# EAGLE design isibtvschema (EAGLE 9.5.1)
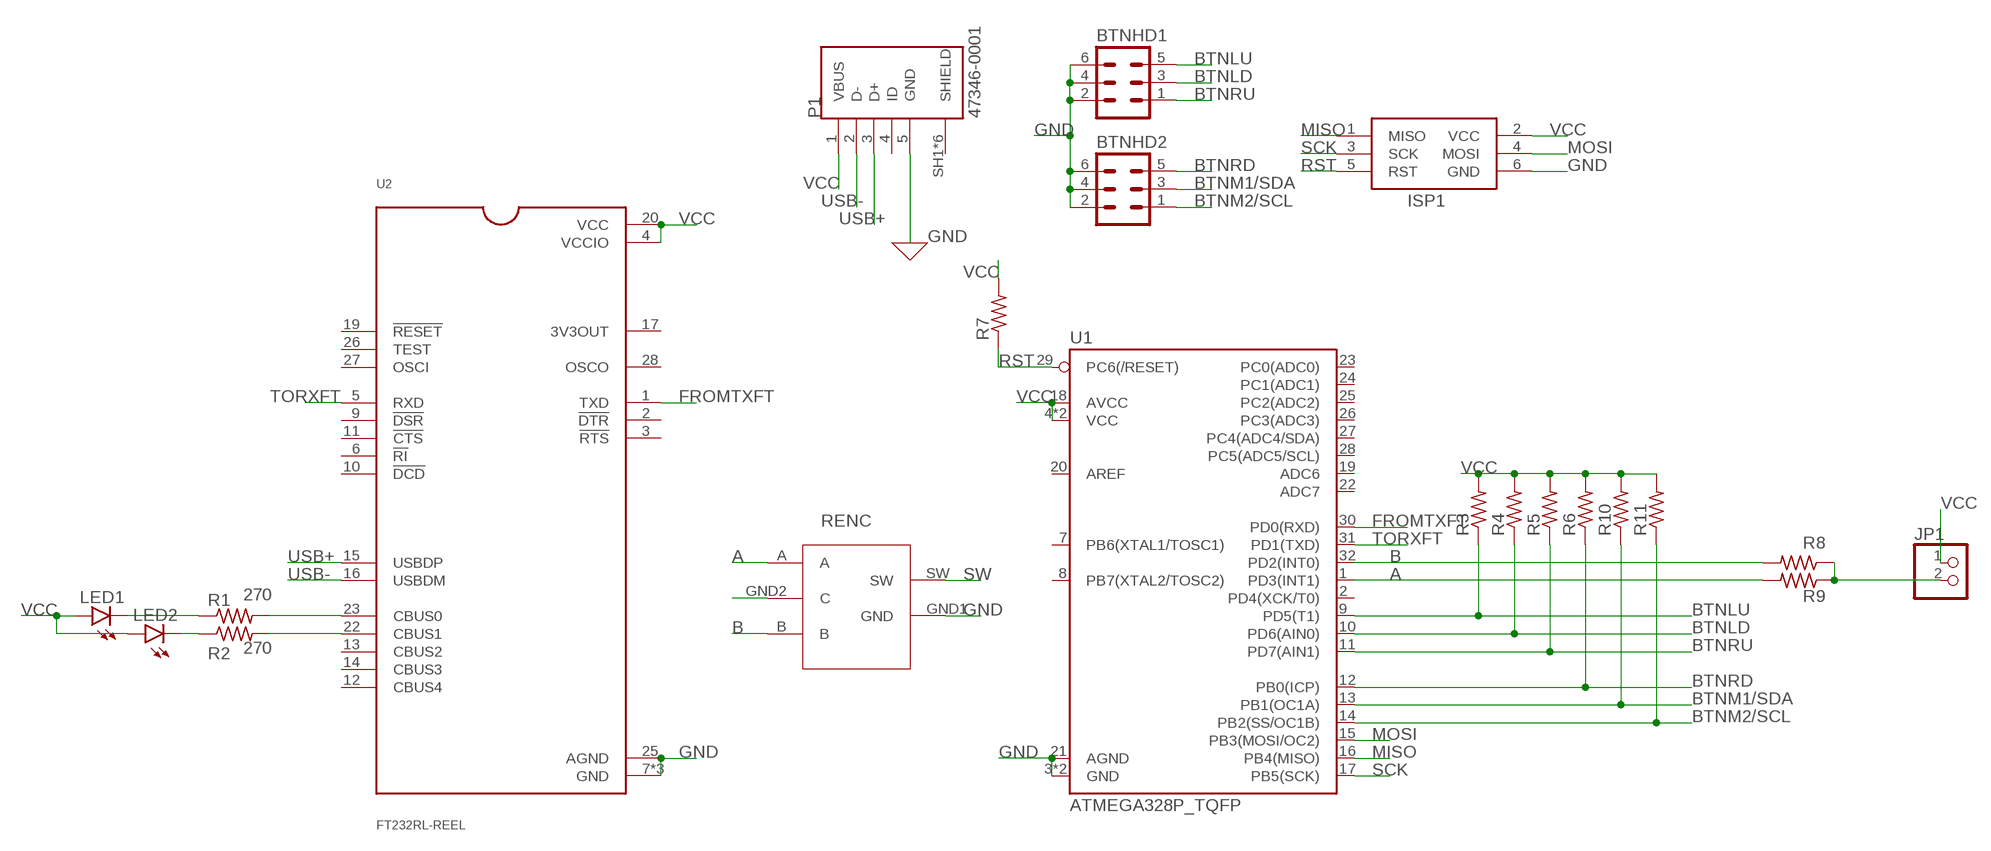
[diagram p0: schematic, sheet 1]

## Parts
BTNHD1  MA03-2  [MA03-2]
BTNHD2  MA03-2  [MA03-2]
ISP1  AVRISP-6  [AVRISP]
JP1  PINHD-1X2  [1X02]
LED1  LED5MM  [LED5MM]
LED2  LED5MM  [LED5MM]
P1  47346-0001  [MOLEX_47346-0001]
R1  270  R-US_0207/10  [0207/10]
R2  270  R-US_0207/10  [0207/10]
R3  R-US_0207/10  [0207/10]
R4  R-US_0207/10  [0207/10]
R5  R-US_0207/10  [0207/10]
R6  R-US_0207/10  [0207/10]
R7  R-US_0207/10  [0207/10]
R8  R-US_0207/10  [0207/10]
R9  R-US_0207/10  [0207/10]
R10  R-US_0207/10  [0207/10]
R11  R-US_0207/10  [0207/10]
RENC  RE11  [RE11]
U1  ATMEGA328P_TQFP  [TQFP32-08]
U2  FT232RL-REEL  [SOP65P780X200-28N]

## Nets
A: R9.2 RENC.A U1.1(PD3(INT1))
B: R8.2 RENC.B U1.32(PD2(INT0))
BTNLD: BTNHD1.3 R4.1 U1.10(PD6(AIN0))
BTNLU: BTNHD1.5 R3.1 U1.9(PD5(T1))
BTNM1/SDA: BTNHD2.3 R10.1 U1.13(PB1(OC1A))
BTNM2/SCL: BTNHD2.1 R11.1 U1.14(PB2(SS/OC1B))
BTNRD: BTNHD2.5 R6.1 U1.12(PB0(ICP))
BTNRU: BTNHD1.1 R5.1 U1.11(PD7(AIN1))
FROMTXFT: U1.30(PD0(RXD)) U2.1(TXD)
GND: BTNHD1.2 BTNHD1.4 BTNHD1.6 BTNHD2.2 BTNHD2.4 BTNHD2.6 ISP1.6(GND) P1.5(GND) RENC.GND1(GND) RENC.GND2(C) U1.3(GND) U1.5(GND) U1.21(AGND) U2.7(GND) U2.18(GND) U2.21(GND) U2.25(AGND)
MISO: ISP1.1(MISO) U1.16(PB4(MISO))
MOSI: ISP1.4(MOSI) U1.15(PB3(MOSI/OC2))
N$1: R1.2 U2.23(CBUS0)
N$2: R2.2 U2.22(CBUS1)
N$3: LED1.K(C) R1.1
N$4: LED2.K(C) R2.1
N$7: JP1.2 R8.1 R9.1
RST: ISP1.5(RST) R7.1 U1.29(PC6(/RESET))
SCK: ISP1.3(SCK) U1.17(PB5(SCK))
SW: RENC.SW
TORXFT: U1.31(PD1(TXD)) U2.5(RXD)
USB+: P1.3(D+) U2.15(USBDP)
USB-: P1.2(D-) U2.16(USBDM)
VCC: ISP1.2(VCC) JP1.1 LED1.A LED2.A P1.1(VBUS) R3.2 R4.2 R5.2 R6.2 R7.2 R10.2 R11.2 U1.4(VCC) U1.6(VCC) U1.18(AVCC) U2.4(VCCIO) U2.20(VCC)
Unconnected: P1.4(ID) P1.SH1(SHIELD) P1.SH2(SHIELD) P1.SH3(SHIELD) P1.SH4(SHIELD) P1.SH5(SHIELD) P1.SH6(SHIELD) U1.2(PD4(XCK/T0)) U1.7(PB6(XTAL1/TOSC1)) U1.8(PB7(XTAL2/TOSC2)) U1.19(ADC6) U1.20(AREF) U1.22(ADC7) U1.23(PC0(ADC0)) U1.24(PC1(ADC1)) U1.25(PC2(ADC2)) U1.26(PC3(ADC3)) U1.27(PC4(ADC4/SDA)) U1.28(PC5(ADC5/SCL)) U2.2(!DTR) U2.3(!RTS) U2.6(!RI) U2.9(!DSR) U2.10(!DCD) U2.11(!CTS) U2.12(CBUS4) U2.13(CBUS2) U2.14(CBUS3) U2.17(3V3OUT) U2.19(!RESET) U2.26(TEST) U2.27(OSCI) U2.28(OSCO)

## Library data of the parts
BTNHD1 BTNHD2 = con-lstb:MA03-2: PIN HEADER; OC_FARNELL: unknown; OC_NEWARK: unknown
ISP1 = adafruit:AVRISP: AVR ISP HEADER Standard 6 pin header for AVR programming
JP1 = pinhead:PINHD-1X2: PIN HEADER
LED1 LED2 = led:LED: LED OSRAM: - CHIPLED LG R971, LG N971, LY N971, LG Q971, LY Q971, LO R971, LY R971 LH N974, LH R974 LS Q976, LO Q976, LY Q976 LO Q996 - Hyper CHIPLED LW Q18S LB Q993, LB Q99A, LB R99A - SideLED LS A670, LO A670, LY A670, LG A670, LP A670 LB A673, LV A673, LT A673, LW A673 LH A674 LY A675 LS A676, LA A676, LO A676, LY A676, LW A676 LS A679, LY A679, LG A679 - Hyper Micro SIDELED® LS Y876, LA Y876, LO Y876, LY Y876 LT Y87S - SmartLED LW L88C, LW L88S LB L89C, LB L89S, LG L890 LS L89K, LO L89K, LY L89K LS L896, LA L896, LO L896, LY L896 - TOPLED LS T670, LO T670, LY T670, LG T670, LP T670 LSG T670, LSP T670, LSY T670, LOP T670, LYG T670 LG T671, LOG T671, LSG T671 LB T673, LV T673, LT T673, LW T673 LH T674 LS T676, LA T676, LO T676, LY T676, LB T676, LH T676, LSB T676, LW T676 LB T67C, LV T67C, LT T67C, LS T67K, LO T67K, LY T67K, LW E67C LS E67B, LA E67B, LO E67B, LY E67B, LB E67C, LV E67C, LT E67C LW T67C LS T679, LY T679, LG T679 LS T770, LO T770, LY T770, LG T770, LP T770 LB T773, LV T773, LT T773, LW T773 LH T774 LS E675, LA E675, LY E675, LS T675 LS T776, LA T776, LO T776, LY T776, LB T776 LHGB T686 LT T68C, LB T68C - Hyper Mini TOPLED® LB M676 - Mini TOPLED Santana® LG M470 LS M47K, LO M47K, LY M47K Source: http://www.osram.convergy.de LUXEON: - LUMILED® LXK2-PW12-R00, LXK2-PW12-S00, LXK2-PW14-U00, LXK2-PW14-V00 LXK2-PM12-R00, LXK2-PM12-S00, LXK2-PM14-U00 LXK2-PE12-Q00, LXK2-PE12-R00, LXK2-PE12-S00, LXK2-PE14-T00, LXK2-PE14-U00 LXK2-PB12-K00, LXK2-PB12-L00, LXK2-PB12-M00, LXK2-PB14-N00, LXK2-PB14-P00, LXK2-PB14-Q00 LXK2-PR12-L00, LXK2-PR12-M00, LXK2-PR14-Q00, LXK2-PR14-R00 LXK2-PD12-Q00, LXK2-PD12-R00, LXK2-PD12-S00 LXK2-PH12-R00, LXK2-PH12-S00 LXK2-PL12-P00, LXK2-PL12-Q00, LXK2-PL12-R00 Source: www.luxeon.com KINGBRIGHT: KA-3528ASYC Source: www.kingbright.com
P1 = USBConnector:47346-0001: CONN RCPT 5POS MICRO USB R/A SMD; AVAILABILITY: Unavailable; DESCRIPTION: Micro-USB B Receptacle with Flange, Bottom Mount, SMT, Lead-Free; MF: Molex; MP: 47346-0001; PACKAGE: None; PRICE: None
R1-R11 = resistor:R-US_: RESISTOR, American symbol
RENC = RotaryEncoder:RE11
U1 = SparkFun-IC-Microcontroller:ATMEGA328P_TQFP: Popular 328P in QFP Storefront component: ATmega328 - TQFP <https://www.sparkfun.com/products/13448> (COM-13448) Datasheet <http://www.sparkfun.com/datasheets/Components/SMD/ATMega328.pdf> SparkFun Products SparkFun RedBoard - Programmed with Arduino <https://www.sparkfun.com/products/12757> (DEV-12757) Arduino Pro Mini 328 - 5V/16MHz <https://www.sparkfun.com/products/11113> (DEV-11113) Arduino Pro Mini 328 - 3.3V/8MHz <https://www.sparkfun.com/products/11114> (DEV-11114) SparkFun OpenLog <https://www.sparkfun.com/products/13712> (DEV-13712) SparkFun MicroView - OLED Arduino Module <https://www.sparkfun.com/products/12923> (DEV-12923) SparkFun Digital Sandbox <https://www.sparkfun.com/products/12651> (DEV-12651) SparkFun PicoBoard <https://www.sparkfun.com/products/11888> (WIG-11888) Arduino Fio <https://www.sparkfun.com/products/10116> (DEV-10116) LilyPad Arduino 328 Main Board <https://www.sparkfun.com/products/13342> (DEV-13342) SparkFun RedStick <https://www.sparkfun.com/products/13741> (DEV-13741) LilyPad MP3 <https://www.sparkfun.com/products/11013> (DEV-11013) LilyPad Arduino SimpleSnap <https://www.sparkfun.com/products/10941> (DEV-10941) SparkFun Stepoko <https://www.sparkfun.com/products/13899> (ROB-13899) SparkFun Geiger Counter <https://www.sparkfun.com/products/11345> (SEN-11345) SparkFun EL Sequencer <https://www.sparkfun.com/products/12781> (COM-12781) Arduino Pro 328 - 5V/16MHz <https://www.sparkfun.com/products/10915> (DEV-10915) CryptoCape <https://www.sparkfun.com/products/12773> (DEV-12773) SparkFun IR Thermometer Evaluation Board - MLX90614 <https://www.sparkfun.com/products/10740> (SEN-10740) SparkFun RedBot Mainboard <https://www.sparkfun.com/products/12097> (ROB-12097) Arduino Pro 328 - 3.3V/8MHz <https://www.sparkfun.com/products/10914> (DEV-10914) SparkFun Block for Intel® Edison - Arduino <https://www.sparkfun.com/products/13036> (DEV-13036) SparkFun Simon Says - Surface Mount Soldering Kit <https://www.sparkfun.com/products/10935> (KIT-10935) SparkFun 7-Segment Serial Display - Red <https://www.sparkfun.com/products/11441> (COM-11441) SparkFun 7-Segment Serial Display - White <https://www.sparkfun.com/products/11629> (COM-11629) SparkFun 7-Segment Serial Display - Yellow <https://www.sparkfun.com/products/11443> (COM-11443) SparkFun 7-Segment Serial Display - Kelly Green <https://www.sparkfun.com/products/11440> (COM-11440) SparkFun 7-Segment Serial Display - Blue <https://www.sparkfun.com/products/11442> (COM-11442) SparkFun OpenSegment Serial Display - 20mm (Blue) <https://www.sparkfun.com/products/11647> (COM-11647) SparkFun OpenSegment Serial Display - 20mm (Green) <https://www.sparkfun.com/products/11646> (COM-11646) SparkFun OpenSegment Serial Display - 20mm (White) <https://www.sparkfun.com/products/11648> (COM-11648) SparkFun OpenSegment Serial Display - 20mm (Red) <https://www.sparkfun.com/products/11644> (COM-11644) SparkFun OpenSegment Serial Display - 20mm (Yellow) <https://www.sparkfun.com/products/11645> (COM-11645) SparkFun OpenSegment Shield <https://www.sparkfun.com/products/13190> (DEV-13190); PROD_ID: IC-09069
U2 = FT232RL-REEL:FT232RL-REEL: USB to serial UART interface; AVAILABILITY: Unavailable; DESCRIPTION: USB Full Speed to Serial UART IC, Includes Oscillator and EEPROM - SSOP-28; MF: FTDI,; MP: FT232RL-REEL; PACKAGE: SSOP-28 FTDI; PRICE: None

## Board
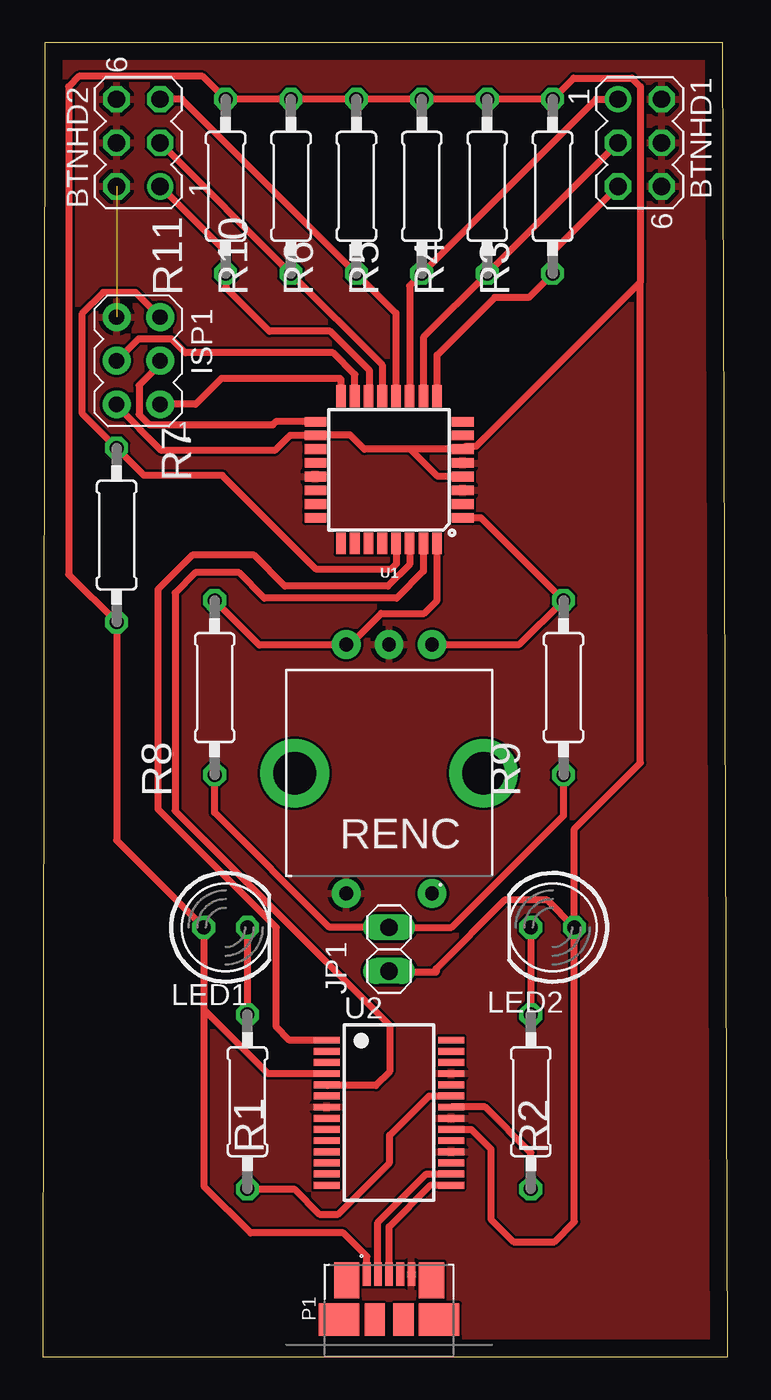
[diagram p1: board, top side]

Size 39.9 x 76.55 mm. Coordinates in mm from the lower left corner, seen from the top.
Outline: 0,0 39.9,0 39.6,76.55 0.1,76.55 0,0
Copper layers (1*16): Top 0.035mm / dielectric 1.5mm / Bottom 0.035mm
Design rules "default": minimum track width 6mil, minimum drill 0.35mm, track to track 6mil, track to pad 6mil, pad to pad 6mil, via to via 6mil, smd to smd 6mil, copper to edge 40mil, drill to drill 6mil, minimum pad ring 10mil, minimum via ring 8mil, stop-mask expansion 4mil, vias tented up to drill 0mil, thermal gap 10mil

### Footprints (pad centres in the part's own frame; a part is rotated, then mirrored left to right if it is on the bottom)
MA03-2 = drill 1.016: 1 -2.54,-1.27 | drill 1.016 octagon: 2 -2.54,1.27; 3 0,-1.27; 4 0,1.27; 5 2.54,-1.27; 6 2.54,1.27
AVRISP = drill 0.9 pad 1.626: 1 -1.27,2.54; 2 1.27,2.54; 3 -1.27,0; 4 1.27,0; 5 -1.27,-2.54; 6 1.27,-2.54
1X02 = drill 1.016 long: 1 -1.27,0; 2 1.27,0
LED5MM = drill 0.813 octagon: A -1.27,0; K 1.27,0
MOLEX_47346-0001 = smd 0.45 x 1.38: 1 -1.3,2.66; 2 -0.65,2.66; 3 0,2.66; 4 0.65,2.66; 5 1.3,2.66 | smd 1.475 x 2.1: SH1 -2.462,2.3; SH2 2.462,2.3 | smd 2.375 x 1.9: SH3 -2.913,0; SH6 2.913,0 | smd 1.175 x 1.9: SH4 -0.838,0; SH5 0.838,0
0207/10 = drill 0.813 octagon: 1 -5.08,0; 2 5.08,0
RE11 = drill 0.8 pad 1.676: A -2.5,-9.5; B 2.5,-9.5; GND1 2.5,5; GND2 0,-9.5; SW -2.5,5 | drill 2.5 pad 4: M1 -5.5,-2; M2 5.5,-2
TQFP32-08 = smd 1.27 x 0.559: 1 -4.293,2.8; 2 -4.293,2; 3 -4.293,1.2; 4 -4.293,0.4; 5 -4.293,-0.4; 6 -4.293,-1.2; 7 -4.293,-2; 8 -4.293,-2.8; 17 4.293,-2.8; 18 4.293,-2; 19 4.293,-1.2; 20 4.293,-0.4; 21 4.293,0.4; 22 4.293,1.2; 23 4.293,2; 24 4.293,2.8 | smd 0.559 x 1.27: 9 -2.8,-4.293; 10 -2,-4.293; 11 -1.2,-4.293; 12 -0.4,-4.293; 13 0.4,-4.293; 14 1.2,-4.293; 15 2,-4.293; 16 2.8,-4.293; 25 2.8,4.293; 26 2,4.293; 27 1.2,4.293; 28 0.4,4.293; 29 -0.4,4.293; 30 -1.2,4.293; 31 -2,4.293; 32 -2.8,4.293
SOP65P780X200-28N = smd 1.5 x 0.4: 1 -3.625,4.225; 2 -3.625,3.575; 3 -3.625,2.925; 4 -3.625,2.275; 5 -3.625,1.625; 6 -3.625,0.975; 7 -3.625,0.325; 8 -3.625,-0.325; 9 -3.625,-0.975; 10 -3.625,-1.625; 11 -3.625,-2.275; 12 -3.625,-2.925; 13 -3.625,-3.575; 14 -3.625,-4.225; 15 3.625,-4.225; 16 3.625,-3.575; 17 3.625,-2.925; 18 3.625,-2.275; 19 3.625,-1.625; 20 3.625,-0.975; 21 3.625,-0.325; 22 3.625,0.325; 23 3.625,0.975; 24 3.625,1.625; 25 3.625,2.275; 26 3.625,2.925; 27 3.625,3.575; 28 3.625,4.225

### Placement (x,y rotation side)
BTNHD1  34.77,70.73 270 top
BTNHD2  5.56,70.73 90 top
ISP1  5.56,58.03 180 top
JP1  20.16,23.74 90 top
LED1  10.64,25.01 0 top
LED2  29.69,25.01 180 top
P1  20.16,2.15 0 top
R1  11.91,14.85 270 top
R2  28.42,14.85 270 top
R3  29.69,68.19 90 top
R4  25.88,68.19 90 top
R5  22.07,68.19 90 top
R6  18.26,68.19 90 top
R7  4.29,47.87 270 top
R8  10.01,38.98 90 top
R9  30.32,38.98 90 top
R10  14.45,68.19 90 top
R11  10.64,68.19 90 top
RENC  20.16,32 180 top
U1  20.16,51.68 180 top
U2  20.16,14.21 0 top

### Tracks (layer width: path | path; a pad name or v marks a point on that pad's centre or on a via)
A
  Top 0.4: U1.1 25.5,48.88 R9.2 27.76,41.49 RENC.A
B
  Top 0.4: R8.2 12.61,41.46 17.63,41.46 RENC.B 17.89,41.49 19.7,43.3 22.2,43.3 22.96,44.06 U1.32
BTNLD
  Top 0.4: BTNHD1.3 R4.1 22.16,59.4 U1.10
BTNLU
  Top 0.4: BTNHD1.5 29.69,64.38 R3.1 28.29,61.71 26.31,61.71 22.96,58.37 U1.9
BTNM1/SDA
  Top 0.4: BTNHD2.3 R10.1 19.77,57.8 U1.13
BTNM2/SCL
  Top 0.4: BTNHD2.1 10.64,64.38 R11.1 10.64,62.3 13.19,59.75 16.73,59.75 19,57.48 19,56 U1.14
BTNRD
  Top 0.4: BTNHD2.5 8.1,73.27 R6.1 20.57,60.8 U1.12
BTNRU
  Top 0.4: BTNHD1.1 32.23,73.27 R5.1 21.36,62.41 U1.11
FROMTXFT
  Top 0.4: U1.30 21.36,46.16 20.1,44.9 14.1,44.9 12.3,46.7 8.7,46.7 6.7,44.7 6.7,31.9 13.6,25 13.6,19.2 14.36,18.44 U2.1
GND  (1 unrouted)
  pour Top: 0.3,76.1 0.3,0.5 38.7,0.5 38.7,76.1
MISO
  Top 0.4: U1.16 17.36,56.94 17.3,57 10.4,57 8.89,55.49 ISP1.1
MOSI
  Top 0.4: U1.15 18.16,57.23 16.9,58.5 8.3,58.5 7.5,59.3 5.56,59.3 ISP1.4
N$1
  Top 0.4: R1.2 14.63,9.77 16.1,8.3 17.2,8.3 20.2,11.3 20.2,12.9 22.49,15.19 U2.23
N$2
  Top 0.4: R2.2 28.42,11.88 25.76,14.54 U2.22
N$3
  Top 0.4: LED1.K R1.1
N$4
  Top 0.4: LED2.K R2.1
N$7
  Top 0.4: R9.1 30.32,31.52 23.81,25.01 JP1.2 16.69,25.01 10,31.7 R8.1
RST
  Top 0.4: ISP1.5 5.4,62 3.5,62 2.3,60.8 2.3,54.94 R7.1 5.89,51.35 10.45,51.35 15.9,45.9 20.3,45.9 20.6,46.2 20.6,47.35 U1.29
SCK
  Top 0.4: ISP1.3 6.83,57.83 5.6,56.6 5.6,54.9 6.2,54.3 13.4,54.3 13.6,54.5 15.85,54.5 U1.17
TORXFT
  Top 0.4: U2.5 16.58,15.8 19.4,15.8 20.2,16.6 20.2,19.3 7.7,31.8 7.7,44.5 8.87,45.67 11.43,45.67 12.9,44.2 20.6,44.2 22.16,45.77 U1.31
USB+
  Top 0.4: P1.3 20.16,7.57 22.6,10 U2.15
USB-
  Top 0.4: P1.2 19.52,7.82 22.34,10.64 U2.16
VCC
  Top 0.4: 9.37,20.23 LED1.A 4.29,30.09 R7.2 1.5,45.58 1.5,74 2.1,74.6 9.31,74.6 R11.2 R10.2 R6.2 R5.2 R4.2 R3.2 30.92,74.5 34.3,74.5 34.8,74 34.8,62.61 | U2.4 13.11,16.49 9.37,20.23 | U2.20 24.96,13.24 26.1,12.1 26.1,8 27.4,6.7 29.8,6.7 30.96,7.86 LED2.A | LED2.A 29.37,26.6 26.9,26.6 22.9,22.6 22.9,22.4 20.23,22.4 JP1.1 | ISP1.2 4.29,55.41 6.9,52.8 13.5,52.8 14.38,53.68 U1.18 15.89,53.7 17.9,53.7 18.72,52.88 21.4,52.88 | 21.4,52.88 U1.6 24.63,53.05 25.24,53.05 34.8,62.61 | U1.4 23,51.28 21.4,52.88 | LED2.A 30.96,30.76 34.8,34.6 34.8,62.61 | 9.37,20.23 9.37,9.93 12.1,7.2 17.5,7.2 18.86,5.83 P1.1